# EAGLE design vrs (EAGLE 6.0)
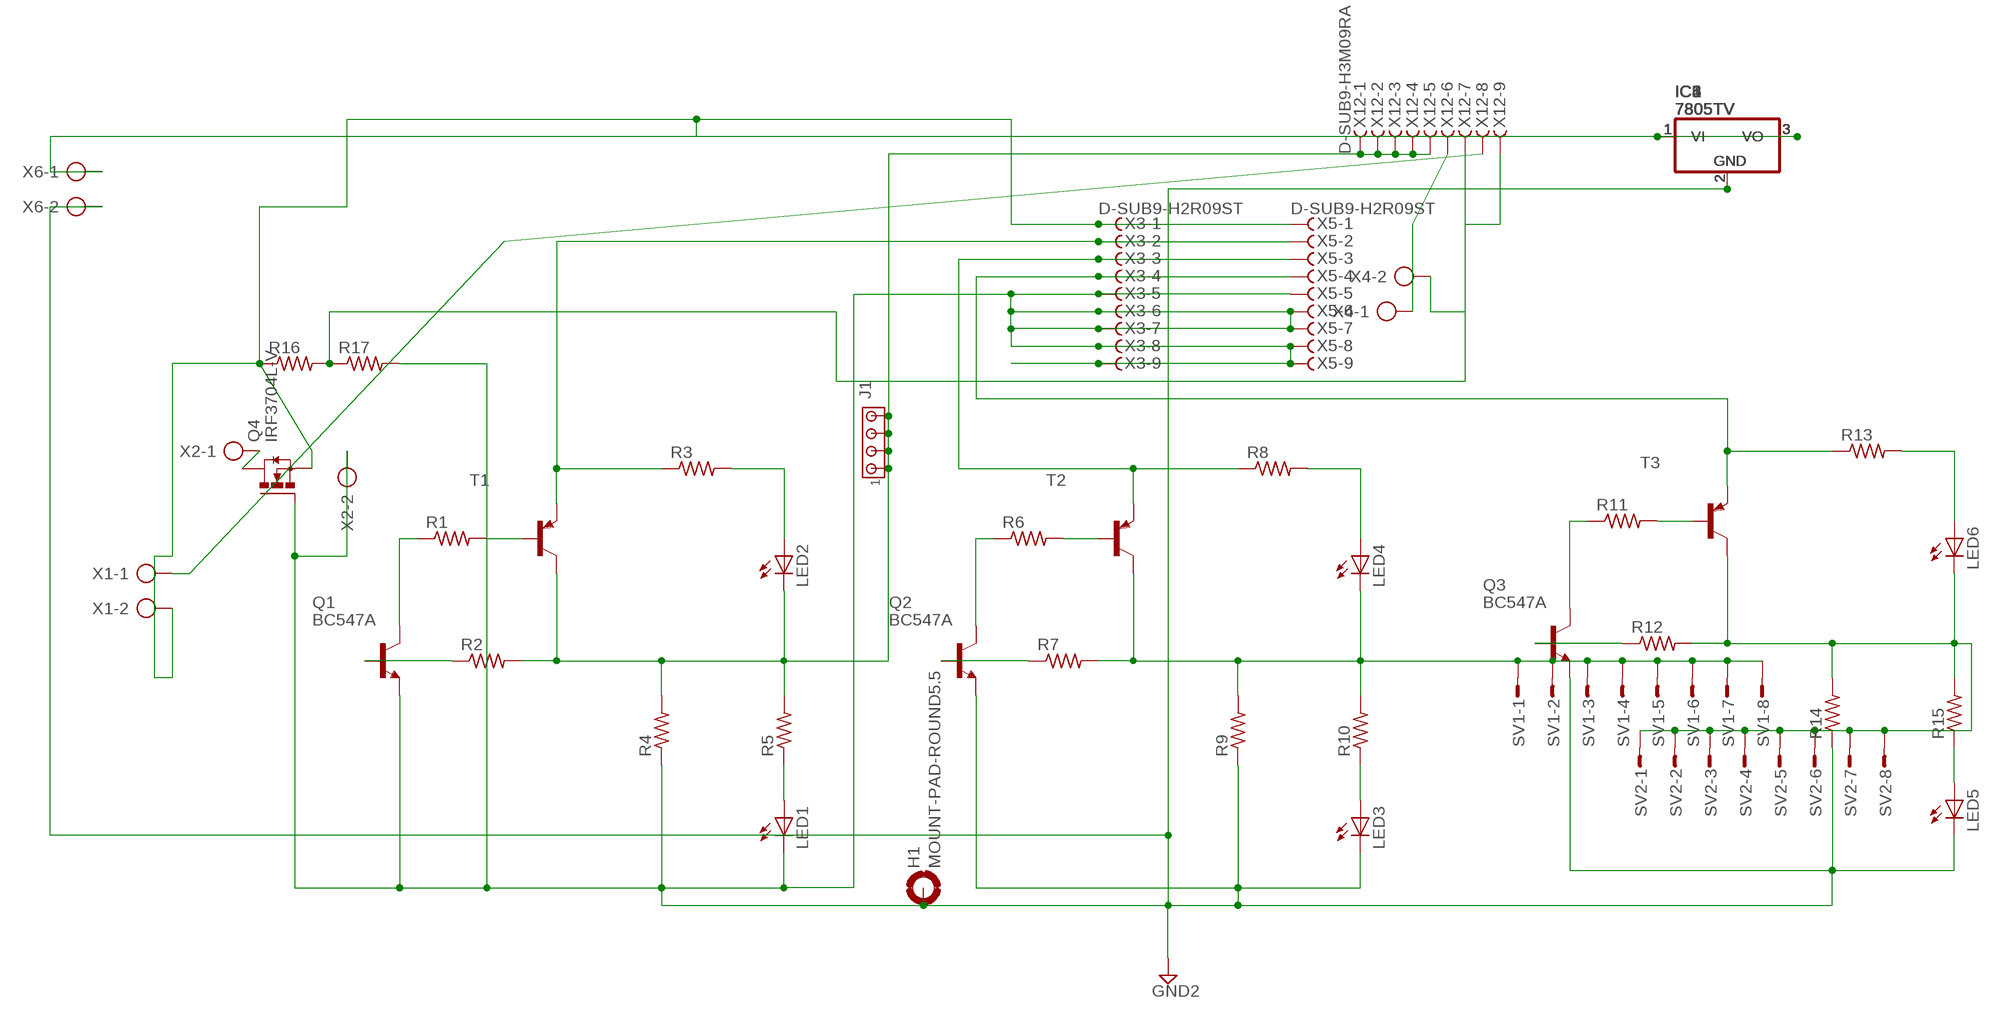
[diagram p0: schematic, sheet 1]

## Parts
H1  MOUNT-PAD-ROUND5.5  [5,5-PAD]
IC1  7805TV  [TO220V]
IC2  7805TV  [TO220V]
IC3  7805TV  [TO220V]
IC4  7805TV  [TO220V]
IC5  7805TV  [TO220V]
IC6  7805TV  [TO220V]
J1  MTA04-156  [1X4MTA]
LED1  LED3MM  [LED3MM]
LED2  LED3MM  [LED3MM]
LED3  LED3MM  [LED3MM]
LED4  LED3MM  [LED3MM]
LED5  LED3MM  [LED3MM]
LED6  LED3MM  [LED3MM]
Q1  BC547A  [TO92]
Q2  BC547A  [TO92]
Q3  BC547A  [TO92]
Q4  IRF3704L-V  [TO262-V]
R1  R-US_0207/10  [0207/10]
R2  R-US_0207/10  [0207/10]
R3  R-US_0207/10  [0207/10]
R4  R-US_0207/10  [0207/10]
R5  R-US_0207/10  [0207/10]
R6  R-US_0207/10  [0207/10]
R7  R-US_0207/10  [0207/10]
R8  R-US_0207/10  [0207/10]
R9  R-US_0207/10  [0207/10]
R10  R-US_0207/10  [0207/10]
R11  R-US_0207/10  [0207/10]
R12  R-US_0207/10  [0207/10]
R13  R-US_0207/10  [0207/10]
R14  R-US_0207/10  [0207/10]
R15  R-US_0207/10  [0207/10]
R16  R-US_0207/10  [0207/10]
R17  R-US_0207/10  [0207/10]
SV1  MT6-8Y  [MT6-8Y]
SV2  MT6-8Y  [MT6-8Y]
T1  -PNP-TO92L  [TO92L]
T2  -PNP-TO92L  [TO92L]
T3  -PNP-TO92L  [TO92L]
X1  AK300/2  [AK300/2]
X2  AK300/2  [AK300/2]
X3  D-SUB9-H2R09ST  [H2R09ST]
X4  AK300/2  [AK300/2]
X5  D-SUB9-H2R09ST  [H2R09ST]
X6  AK300/2  [AK300/2]
X12  D-SUB9-H3M09RA  [H3M09RA]

## Nets
GND2: H1.B5,5(MOUNT) IC1.2(GND) IC2.2(GND) IC3.2(GND) IC4.2(GND) IC5.2(GND) IC6.2(GND) LED1.K(C) LED3.K(C) LED5.K(C) Q1.1(E) Q2.1(E) Q3.1(E) Q4.1(G) R4.1 R9.1 R14.1 R17.2 X2.2 X3.5 X3.6 X3.7 X3.8 X3.9 X5.5 X5.6 X5.7 X5.8 X5.9 X6.2
N$1: Q2.2(B) R7.1
N$2: Q2.3(C) R6.1
N$3: R6.2 T2.2(B)
N$4: Q1.2(B) R2.1
N$5: Q1.3(C) R1.1
N$6: R1.2 T1.2(B)
N$8: Q4.2(D) X2.1
N$9: LED1.A R5.1
N$10: J1.1 J1.2 J1.3 J1.4 LED2.K(C) R2.2 R4.2 R5.2 T1.3(C) X12.1 X12.2 X12.3 X12.4 X12.5
N$11: LED2.A R3.2
N$12: LED4.K(C) R7.2 R9.2 R10.2 SV1.1 SV1.2 SV1.3 SV1.4 SV1.5 SV1.6 SV1.7 SV1.8 T2.3(C)
N$13: X4.2 X12.7
N$14: LED3.A R10.1
N$15: R16.2 R17.1 X12.9
N$16: LED4.A R8.2
N$17: Q3.2(B) R12.1
N$18: Q3.3(C) R11.1
N$19: R11.2 T3.2(B)
N$20: LED6.K(C) R12.2 R14.2 R15.2 SV2.1 SV2.2 SV2.3 SV2.4 SV2.5 SV2.6 SV2.7 SV2.8 T3.3(C)
N$21: X4.1 X12.6
N$22: LED5.A R15.1
N$23: X1.1 X12.8
N$24: LED6.A R13.2
N$25: R3.1 T1.1(E) X3.2 X5.2
N$26: R8.1 T2.1(E) X3.3 X5.3
N$27: R13.1 T3.1(E) X3.4 X5.4
N$30: IC1.1(VI) IC2.1(VI) IC3.1(VI) IC4.1(VI) IC5.1(VI) IC6.1(VI) Q4.3(S) R16.1 X1.2 X3.1 X5.1
N$32: IC1.3(VO) IC2.3(VO) IC3.3(VO) IC4.3(VO) IC5.3(VO) IC6.3(VO) X6.1

## Library data of the parts
H1 = holes:MOUNT-PAD-ROUND: MOUNTING PAD, round
IC1-IC6 = linear:78*: Positive VOLTAGE REGULATOR Source: http://cache.national.com/ds/LM/LM78L05.pdf http://www.fairchildsemi.com/ds/LM/LM7805.pdf
J1 = con-amp:MTA04-156: AMP connector
LED1-LED6 = led:LED: LED OSRAM: - CHIPLED LG R971, LG N971, LY N971, LG Q971, LY Q971, LO R971, LY R971 LH N974, LH R974 LS Q976, LO Q976, LY Q976 LO Q996 - Hyper CHIPLED LW Q18S LB Q993, LB Q99A, LB R99A - SideLED LS A670, LO A670, LY A670, LG A670, LP A670 LB A673, LV A673, LT A673, LW A673 LH A674 LY A675 LS A676, LA A676, LO A676, LY A676, LW A676 LS A679, LY A679, LG A679 - Hyper Micro SIDELED® LS Y876, LA Y876, LO Y876, LY Y876 LT Y87S - SmartLED LW L88C, LW L88S LB L89C, LB L89S, LG L890 LS L89K, LO L89K, LY L89K LS L896, LA L896, LO L896, LY L896 - TOPLED LS T670, LO T670, LY T670, LG T670, LP T670 LSG T670, LSP T670, LSY T670, LOP T670, LYG T670 LG T671, LOG T671, LSG T671 LB T673, LV T673, LT T673, LW T673 LH T674 LS T676, LA T676, LO T676, LY T676, LB T676, LH T676, LSB T676, LW T676 LB T67C, LV T67C, LT T67C, LS T67K, LO T67K, LY T67K, LW E67C LS E67B, LA E67B, LO E67B, LY E67B, LB E67C, LV E67C, LT E67C LW T67C LS T679, LY T679, LG T679 LS T770, LO T770, LY T770, LG T770, LP T770 LB T773, LV T773, LT T773, LW T773 LH T774 LS E675, LA E675, LY E675, LS T675 LS T776, LA T776, LO T776, LY T776, LB T776 LHGB T686 LT T68C, LB T68C - Hyper Mini TOPLED® LB M676 - Mini TOPLED Santana® LG M470 LS M47K, LO M47K, LY M47K Source: http://www.osram.convergy.de LUXEON: - LUMILED® LXK2-PW12-R00, LXK2-PW12-S00, LXK2-PW14-U00, LXK2-PW14-V00 LXK2-PM12-R00, LXK2-PM12-S00, LXK2-PM14-U00 LXK2-PE12-Q00, LXK2-PE12-R00, LXK2-PE12-S00, LXK2-PE14-T00, LXK2-PE14-U00 LXK2-PB12-K00, LXK2-PB12-L00, LXK2-PB12-M00, LXK2-PB14-N00, LXK2-PB14-P00, LXK2-PB14-Q00 LXK2-PR12-L00, LXK2-PR12-M00, LXK2-PR14-Q00, LXK2-PR14-R00 LXK2-PD12-Q00, LXK2-PD12-R00, LXK2-PD12-S00 LXK2-PH12-R00, LXK2-PH12-S00 LXK2-PL12-P00, LXK2-PL12-Q00, LXK2-PL12-R00 Source: www.luxeon.com KINGBRIGHT: KA-3528ASYC Source: www.kingbright.com
Q1-Q3 = transistor-npn:BC547*: NPN Transistor
Q4 = transistor-power:IRF3704: SMPS MOSFET HEXFET® Power MOSFET Source: http://www.irf.com/product-info/datasheets/data/irf3704.pdf
R1-R17 = resistor:R-US_: RESISTOR, American symbol
SV1 SV2 = con-amp-mt:MT6-8Y: AMP MT6 CONNECTOR; OC_FARNELL: unknown; OC_NEWARK: unknown
T1-T3 = transistor:*-PNP-: PNP Transistror
X1 X2 X4 X6 = con-ptr500:AK300/2: CONNECTOR; OC_FARNELL: unknown; OC_NEWARK: unknown
X3 X5 X12 = con-thomas-betts:D-SUB9-: D-Subminiatur Connector Source: Electronioc Interconnects European Edition 1998; OC_FARNELL: unknown; OC_NEWARK: unknown

## Board
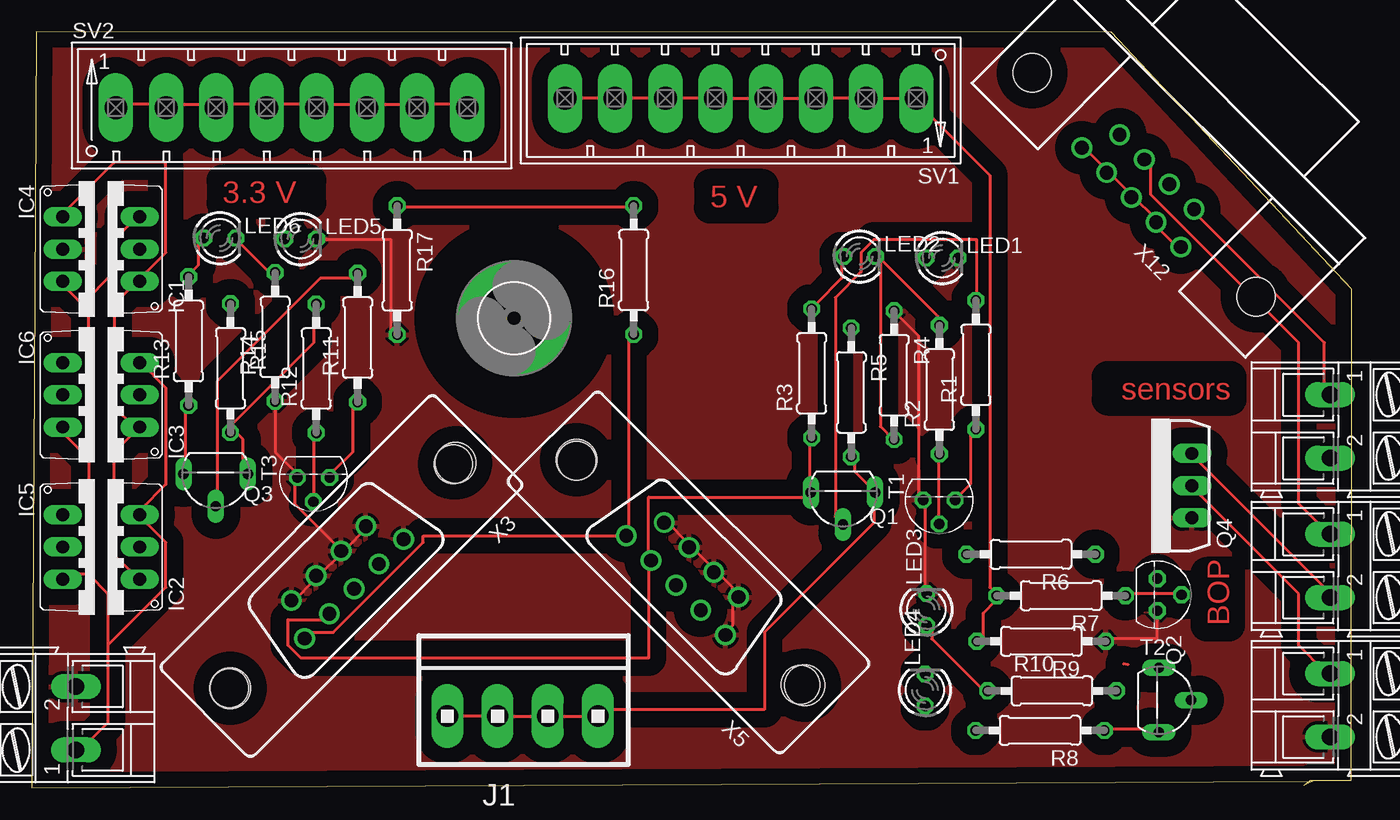
[diagram p1: board, top side]
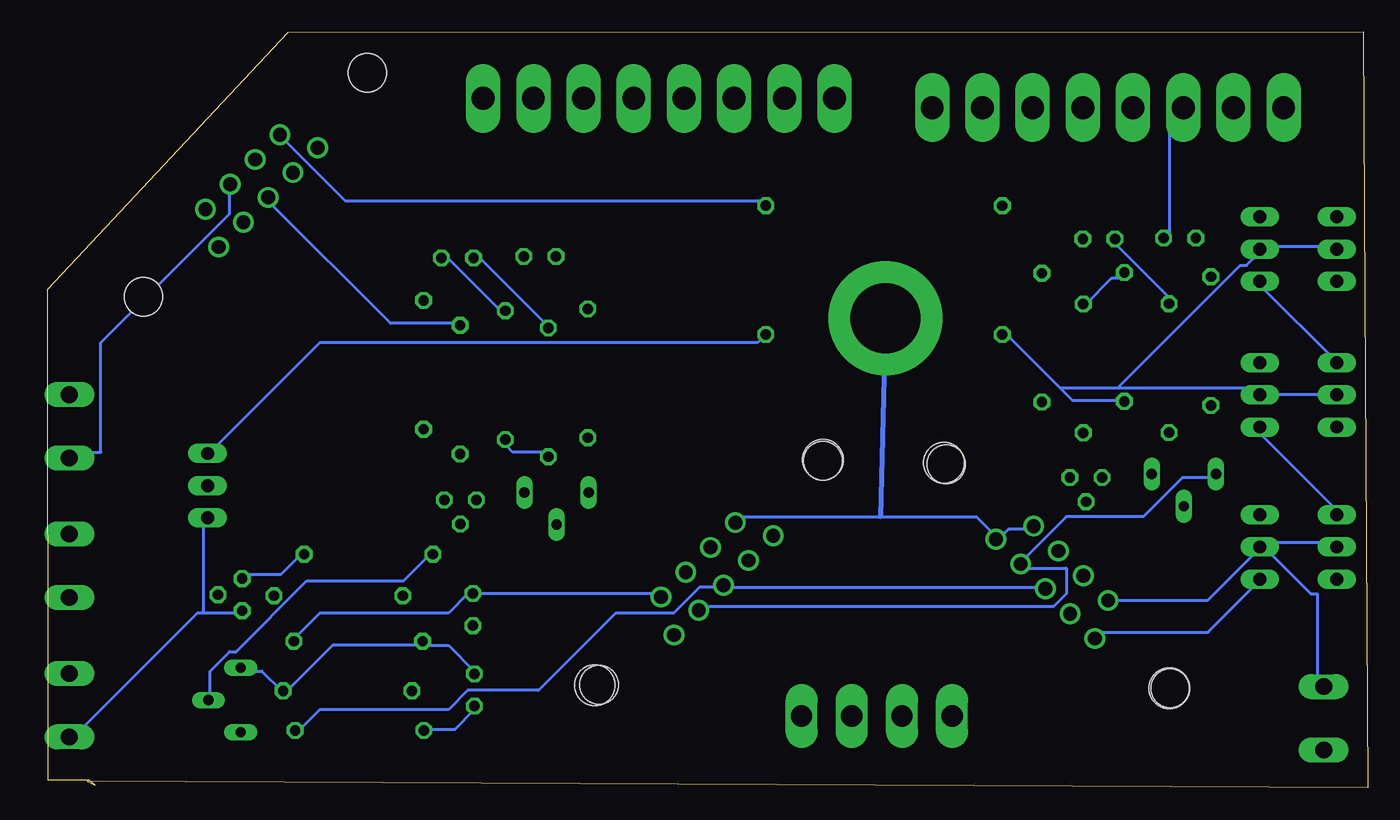
[diagram p2: board, bottom side, seen from below]

Size 104.18 x 59.67 mm. Coordinates in mm from the lower left corner, seen from the top.
Outline: 101.07,0.55 100.45,0.22 100.9,0.6 104.15,0.6 104.18,39.35 85.22,59.64 0.35,59.67 0.25,38.8 0,0 101.07,0.55
Copper layers (1*16): Top 0.035mm / dielectric 1.5mm / Bottom 0.035mm
Design rules: minimum track width 10mil, minimum drill 24mil, track to track 8mil, track to pad 8mil, pad to pad 8mil, via to via 8mil, smd to smd 8mil, copper to edge 40mil, drill to drill 8mil, minimum pad ring 10mil, minimum via ring 8mil, stop-mask expansion 4mil, vias tented up to drill 0mil, thermal gap 10mil
Holes 3.2 mm at 33.45,25.66 15.67,7.88 61.01,8.11 43,25.89

### Footprints (pad centres in the part's own frame; a part is rotated, then mirrored left to right if it is on the bottom)
5,5-PAD = drill 5.5 pad 9: B5,5 0,0
TO220V = drill 1.016 long: 1 -2.54,-2.54; 2 0,-2.54; 3 2.54,-2.54
1X4MTA = drill 1.676 long: 1 5.944,0; 2 1.981,0; 3 -1.981,0; 4 -5.944,0
LED3MM = drill 0.813 octagon: A -1.27,0; K 1.27,0
TO92 = drill 0.813 octagon: 1 1.27,0; 2 0,1.905; 3 -1.27,0
TO262-V = drill 1.016 long: 1 -2.54,0; 2 0,0; 3 2.54,0
0207/10 = drill 0.813 octagon: 1 -5.08,0; 2 5.08,0
MT6-8Y = drill 1.803 long: 1 -13.868,0; 2 -9.906,0; 3 -5.944,0; 4 -1.981,0; 5 1.981,0; 6 5.944,0; 7 9.906,0; 8 13.868,0
TO92L = drill 0.813 long: 1 0,-2.54; 2 2.54,0; 3 0,2.54
AK300/2 = drill 1.321 long: 1 -2.515,0; 2 2.489,0
H2R09ST = drill 1.092: 1 5.537,1.422; 2 2.769,1.422; 3 0,1.422; 4 -2.769,1.422; 5 -5.537,1.422; 6 4.153,-1.422; 7 1.384,-1.422; 8 -1.384,-1.422; 9 -4.153,-1.422 | hole 3.048: -12.497,0; 12.497,0
H3M09RA = drill 1.092: 1 -5.537,1.422; 2 -2.769,1.422; 3 0,1.422; 4 2.769,1.422; 5 5.537,1.422; 6 -4.153,-1.422; 7 -1.384,-1.422; 8 1.384,-1.422; 9 4.153,-1.422 | hole 3.048: -12.497,0; 12.497,0

### Placement (x,y rotation side)
H1  38.08,37.06 0 top
IC1  5.98,42.52 90 top
IC2  5.98,19.02 90 top
IC3  5.98,31.02 90 top
IC4  4.98,42.52 270 top
IC5  4.98,19.02 270 top
IC6  4.98,31.02 270 top
J1  38.75,5.67 0 top
LED1  71.85,41.82 0 top
LED2  65.35,41.94 0 top
LED3  70.63,14.08 90 top
LED4  70.51,7.73 90 top
LED5  21.23,43.32 0 top
LED6  14.84,43.38 0 top
Q1  71.62,22.73 180 top
Q2  88.84,15.25 270 top
Q3  22.24,24.5 180 top
Q4  91.57,23.85 90 top
R1  74.53,33.39 90 top
R2  71.65,31.43 90 top
R3  61.56,32.72 90 top
R4  68.07,32.57 270 top
R5  64.68,31.22 270 top
R6  78.87,18.43 180 top
R7  81.25,15.17 180 top
R8  79.58,4.54 180 top
R9  79.69,11.57 180 top
R10  80.52,7.66 0 top
R11  25.73,35.53 90 top
R12  22.46,33.1 90 top
R13  12.38,35.26 90 top
R14  19.22,35.58 90 top
R15  15.69,33.12 270 top
R16  47.51,40.87 90 top
R17  28.85,40.86 270 top
SV1  55.96,54.41 180 top
SV2  20.52,53.68 0 top
T1  64.03,23.32 270 top
T2  88.97,6.94 0 top
T3  14.52,24.77 270 top
X1  102.48,17.52 270 top
X2  102.48,6.52 270 top
X3  24.44,16.72 225 top
X4  102.48,28.52 270 top
X5  51.85,17 135 top
X6  3.48,5.52 90 top
X12  87.8,47.6 135 top

### Tracks (layer width: path | path; a pad name or v marks a point on that pad's centre or on a via)
GN
  Top 0.254: 86.53,9.73 86.18,9.8
GND2
  Top 0.254: X3.6 20.75,14.81 22.27,16.34 X3.7 22.78,16.85 24.3,18.37 X3.8 | X3.8 24.81,18.88 26.34,20.4 X3.9 | 8.56,31.07 IC3.2 | R14.1 19.22,30.05 19.22,26.5 20.75,24.97 Q3.1 20.75,24.47 20.75,22.43 24.3,18.88 X3.8 | LED5.K 22.78,43.26 28.37,43.26 28.37,36.15 R17.2 | R9.1 85.26,11.77 88.82,11.77 88.82,13.8 Q2.1 | LED3.K 70.53,15.83 70.53,22.43 Q1.1 70.02,22.94 70.02,35.64 68.5,37.17 R4.1 | X5.6 50.21,20.91 51.74,19.39 X5.7 52.24,18.88 53.77,17.35 X5.8 54.28,16.85 55.29,15.83 55.29,15.32 X5.9 55.29,14.81 55.29,12.78 54.78,12.27 X5.5
  Bottom 0.254: IC5.2 2.46,19.39 8.05,19.39 IC2.2 | X6.2 3.98,8.21 3.98,15.32 4.49,15.32 8.05,18.88 IC2.2 | X3.9 26.84,20.4 28.37,20.4 28.88,19.89 X3.5 29.38,19.89 30.91,21.42 38.48,21.42 49.7,21.42 X5.6 | IC4.2 2.46,42.75 8.05,42.75 IC1.2 8.56,42.25 9.57,41.23 10.08,41.23 19.73,31.58 | IC6.2 2.46,31.07 8.05,31.07 IC3.2 8.56,31.07 9.06,31.58 19.73,31.58 | 24.3,31.58 23.29,30.56 19.22,30.56 R14.1 | 24.3,31.58 28.37,35.64 R17.2 | 24.3,31.58 19.73,31.58 | IC2.2 8.56,18.88 12.62,14.81 20.24,14.81 X3.6 | 91.87,13.8 91.87,20.91 Q4.1 | 91.87,13.8 89.33,13.8 Q2.1 | 91.87,13.8 92.38,13.8 102.03,4.15 X2.2 | R4.1 68.5,37.67 72.56,41.74 73.07,41.74 LED1.K | X5.9 55.8,15.32 70.53,15.32 LED3.K 71.04,15.32 72.56,13.8 82.72,13.8 84.76,11.77 R9.1
  Bottom 0.406: H1.B5,5 38.48,21.42
  pour Top (isolate 1.27): -0.42,59.02 85.26,59.52 104.31,40.47 103.81,0 40.83,0.52 -0.42,0.02
N$1
  Top 0.254: R7.1 86.79,15.32 90.34,15.32 Q2.2
N$2
  Bottom 0.254: R6.1 84.25,18.37 85.77,16.85 88.82,16.85 Q2.3
N$3
  Bottom 0.254: R6.2 74.09,18.37 76.12,16.34 83.74,16.34 89.33,10.75 89.84,10.75 91.36,9.23 91.36,7.19 T2.2
N$4
  Top 0.254: Q1.2 71.55,20.91 71.55,25.99 R2.1
N$5
  Top 0.254: Q1.3 73.07,22.94 74.09,23.96 74.09,28.02 R1.1
N$6
  Top 0.254: T1.2 63.93,20.91 63.42,21.42 63.42,38.69 65.45,40.72 65.45,42.25 66.47,43.26 74.6,43.26 74.6,38.69 R1.2
N$8
  Top 0.254: Q4.2 91.87,23.45 100,15.32 100,11.26 102.03,9.23 X2.1
N$9
  Bottom 0.254: R5.1 64.94,36.66 70.02,41.74 70.53,41.74 LED1.A
N$10
  Top 0.254: J1.4 32.94,5.67 36.5,5.67 J1.3 37,5.67 40.56,5.67 J1.2 41.07,5.67 44.62,5.67 J1.1 45.13,6.18 57.83,6.18 57.83,12.27 66.47,20.91 66.47,22.94 T1.3 66.47,23.45 64.94,24.97 64.94,25.99 R5.2 | X12.5 83.23,50.37 84.76,48.85 X12.4 85.26,48.34 86.79,46.82 X12.3 87.3,46.31 88.31,45.29 88.31,44.79 X12.2 88.82,44.28 90.34,42.75 X12.1 | 66.98,41.74 71.55,37.17 71.55,36.66 R2.2 | 66.98,41.74 66.98,28.53 67.99,27.51 R4.2 | 66.98,41.74 LED2.K
  Bottom 0.254: R4.2 67.99,27.01 67.48,26.5 64.94,26.5 R5.2 | X12.3 86.79,46.31 77.14,36.66 72.06,36.66 R2.2
N$11
  Top 0.254: R3.2 61.9,38.18 63.93,40.21 63.93,41.74 LED2.A
N$12
  Top 0.254: R9.2 75.1,11.77 75.1,13.8 76.12,14.81 R7.2 76.12,15.32 75.61,15.83 75.61,48.34 70.02,53.93 SV1.1 69.52,54.44 65.96,54.44 SV1.2 65.45,54.44 62.4,54.44 SV1.3 61.9,54.44 58.34,54.44 SV1.4 57.83,54.44 54.28,54.44 SV1.5 53.77,54.44 50.21,54.44 SV1.6 49.7,54.44 46.15,54.44 SV1.7 45.64,54.44 42.59,54.44 SV1.8
  Bottom 0.254: T2.3 88.82,9.23 87.3,9.23 85.77,7.7 R10.2 85.26,7.7 81.71,11.26 75.1,11.26 R9.2 74.6,11.26 72.56,11.26 70.53,9.23 LED4.K
N$13
  Bottom 0.254: X12.7 89.84,47.33 89.84,45.29 100,35.13 100,26.5 102.03,26.5 X4.2
N$14
  Top 0.254: R10.1 75.1,7.7 71.04,11.77 71.04,12.78 LED3.A
N$15
  Top 0.254: R17.1 28.88,45.8 47.16,45.8 R16.2
  Bottom 0.254: X12.9 85.77,51.39 80.69,46.31 47.67,46.31 R16.2
N$16
  Bottom 0.254: LED4.A 70.53,6.18 72.06,4.65 74.09,4.65 R8.2
N$17
  Top 0.254: Q3.2 22.27,22.94 22.27,27.51 R12.1
N$18
  Top 0.254: Q3.3 23.8,24.97 25.32,26.5 25.32,30.05 R11.1
N$19
  Top 0.254: T3.2 14.65,22.43 14.65,32.09 22.78,40.21 25.32,40.21 R11.2
N$20
  Top 0.254: T3.3 16.68,24.97 16.68,27.51 16.18,28.02 R15.2 15.67,28.53 22.27,35.13 22.27,37.67 R12.2 | LED6.K 16.18,43.26 18.72,40.72 R14.2 | SV2.1 7.03,53.93 10.59,53.93 SV2.2 11.1,53.93 14.14,53.93 SV2.3 14.65,53.93 18.21,53.93 SV2.4 18.72,53.93 22.27,53.93 SV2.5 22.78,53.93 26.34,53.93 SV2.6 26.84,53.93 30.4,53.93 SV2.7 30.91,53.93 33.96,53.93 SV2.8
  Bottom 0.254: R12.2 22.27,38.18 20.24,40.21 19.22,40.21 R14.2 | LED6.K 15.67,43.77 15.67,53.42 14.65,53.42 SV2.3
N$21
  Top 0.254: X12.6 91.87,45.29 102.03,35.13 102.03,31.07 X4.1
N$22
  Bottom 0.254: R15.1 15.67,38.69 20.24,43.26 LED5.A
N$23
  Top 0.254: X12.8 88.31,49.36 88.31,46.82 100,35.13 100,22.43 102.03,20.4 X1.1
N$24
  Top 0.254: R13.2 12.62,40.72 13.13,41.23 13.13,43.26 LED6.A
N$25
  Top 0.254: R3.1 61.39,27.51 61.39,23.45 T1.1 61.39,22.94 48.69,22.94 48.69,18.37 X5.2 48.69,17.86 48.69,10.24 21.26,10.24 20.24,11.26 20.24,13.29 23.29,13.29 X3.2
N$26
  Top 0.254: R8.1 84.76,4.65 88.82,4.65 T2.1
  Bottom 0.254: X3.3 25.83,15.83 50.72,15.83 X5.3 51.23,15.83 52.75,15.83 54.78,13.8 59.36,13.8 65.45,7.7 71.04,7.7 72.56,6.18 82.72,6.18 84.25,4.65 R8.1
N$27
  Top 0.254: T3.1 12.11,24.97 12.11,30.05 R13.1
  Bottom 0.254: T3.1 12.11,24.47 14.65,24.47 17.7,21.42 23.8,21.42 27.35,17.86 X3.4 27.35,17.35 23.8,17.35 23.8,15.32 24.81,14.31 52.75,14.31 X5.4
N$30
  Top 0.254: 8.56,28.53 IC3.1 | IC4.1 2.46,45.29 6.52,49.36 10.59,49.36 10.59,42.25 8.56,40.21 IC1.1 8.05,39.71 6.52,38.18 6.52,30.05 8.05,28.53 IC3.1 | Q4.3 91.87,25.99 102.03,15.83 102.03,15.32 X1.2 | R16.1 47.16,35.64 47.16,20.4 X5.1 46.66,19.89 30.91,19.89 30.91,19.39 23.8,12.27 21.76,12.27 X3.1 | IC3.1 8.05,28.02 6.52,26.5 6.52,18.37 8.05,16.85 IC2.1
  Bottom 0.254: IC5.1 2.46,21.93 8.56,28.02 IC3.1 | IC6.1 2.46,33.61 8.56,39.71 IC1.1 | IC2.1 8.56,16.34 12.62,12.27 21.26,12.27 X3.1 | Q4.3 91.36,26.5 82.72,35.13 48.18,35.13 47.67,35.64 R16.1
N$32
  Top 0.254: IC3.3 8.56,33.61 10.59,31.58 10.59,23.96 8.56,21.93 IC2.3 8.56,21.42 10.59,19.39 10.59,15.83 6.02,11.26 | 4.49,16.85 2.46,16.85 IC5.3 | 4.49,25.99 4.49,16.85 | 4.49,25.99 2.46,28.02 IC6.3 | 3.98,38.18 4.49,37.67 4.49,25.99 | 3.98,38.18 2.46,39.71 IC4.3 | 3.98,38.18 6.52,40.72 6.52,43.26 8.05,44.79 IC1.3 | 6.02,11.26 6.02,15.32 4.49,16.85 | 6.02,11.26 6.02,5.16 3.98,3.13 X6.1

### Text on the board
Top: 3.3 V | 5 V | sensors | BOP